# EAGLE design BleShield (EAGLE 6.4)
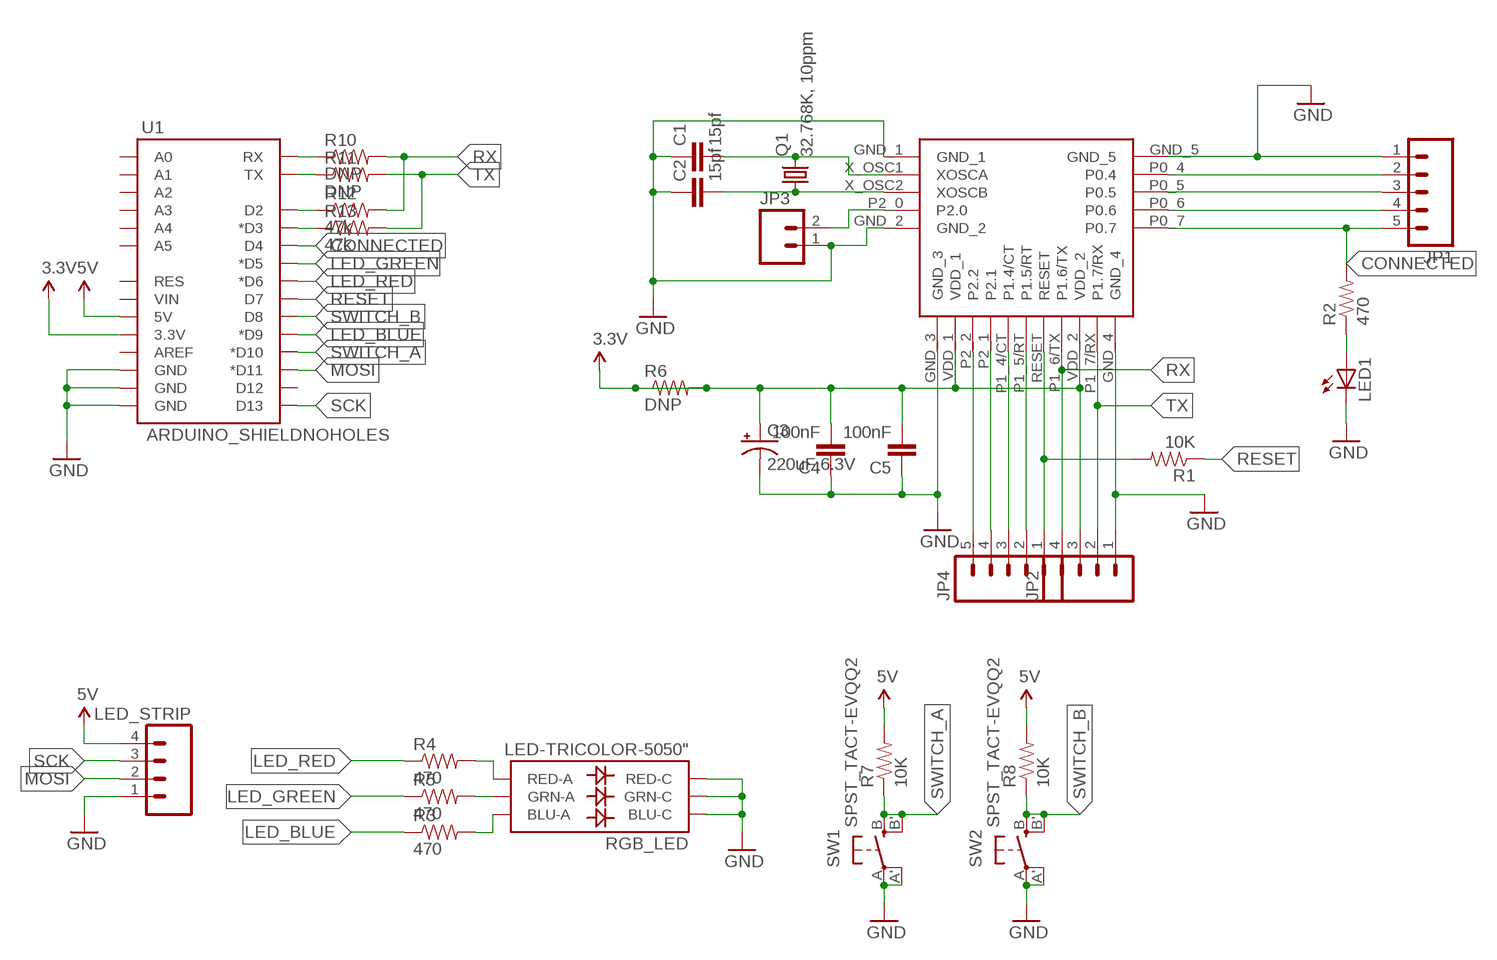
[diagram p0: schematic, sheet 1]

## Parts
C1  15pf  CAP0805  [0805]
C2  15pf  CAP0805  [0805]
C3  220uF 6.3V  CPOL-USC/6032-28R  [C/6032-28R]
C4  100nF  CAP0805  [0805]
C5  100nF  CAP0805  [0805]
JP1  M051.27MM  [1X05-1.27MM]
JP2  M041.27MM  [1X04-1.27MM]
JP3  M02  [1X02-1.27MM]
JP4  M051.27MM  [1X05-1.27MM]
LED1  LEDCHIPLED_0805  [CHIPLED_0805]
LED_STRIP  M04PTH  [1X04]
Q1  32.768K, 10ppm  CRYSTAL3215  [CRYSTAL_3215]
R1  10K  RESISTOR0805-RES  [0805]
R2  470  RESISTOR0805-RES  [0805]
R3  470  RESISTOR0805-RES  [0805]
R4  470  RESISTOR0805-RES  [0805]
R5  470  RESISTOR0805-RES  [0805]
R6  DNP  RESISTOR0805-RES  [0805]
R7  10K  RESISTOR0805-RES  [0805]
R8  10K  RESISTOR0805-RES  [0805]
R10  DNP  RESISTOR0805-RES  [0805]
R11  DNP  RESISTOR0805-RES  [0805]
R12  47k  RESISTOR0805-RES  [0805]
R13  47k  RESISTOR0805-RES  [0805]
RGB_LED  LED-TRICOLOR-5050"  [LED-TRICOLOR-5050-FIXED]
SW1  SPST_TACT-EVQQ2  [EVQ-Q2]
SW2  SPST_TACT-EVQQ2  [EVQ-Q2]
U1  ARDUINO_SHIELDNOHOLES  [DUEMILANOVE_SHIELD_NOHOLES]
U$1  BG213L  [BG312L]

## Nets
3.3V: C3.+ C4.2 C5.2 JP2.3 R6.1 R6.2 U1.3.3V U$1.VDD_1 U$1.VDD_2
5V: LED_STRIP.4 R7.2 R8.2 U1.5V
CONNECTED: JP1.5 R2.2 U1.D4 U$1.P0_7(P0.7)
GND: C1.1 C2.1 C3.- C4.1 C5.1 JP1.1 JP2.1 JP3.1 LED1.C LED_STRIP.1 RGB_LED.1(BLU-C) RGB_LED.2(RED-C) RGB_LED.3(GRN-C) SW1.A'(P1) SW1.A(P) SW2.A'(P1) SW2.A(P) U1.GND@0(GND) U1.GND@1(GND) U1.GND@2(GND) U$1.GND_1 U$1.GND_2 U$1.GND_3 U$1.GND_4 U$1.GND_5
LED_BLUE: R3.1 U1.D9(*D9)
LED_GREEN: R5.1 U1.D5(*D5)
LED_RED: R4.1 U1.D6(*D6)
MOSI: LED_STRIP.2 U1.D11(*D11)
N$1: JP4.1 R1.2 U$1.RESET
N$2: R3.2 RGB_LED.6(BLU-A)
N$3: C1.2 Q1.P$2 U$1.X_OSC1(XOSCA)
N$4: C2.2 Q1.P$1 U$1.X_OSC2(XOSCB)
N$5: R5.2 RGB_LED.4(GRN-A)
N$6: R4.2 RGB_LED.5(RED-A)
N$7: LED1.A R2.1
N$8: JP4.5 U$1.P2_2(P2.2)
N$9: R12.1 U1.D2
N$10: R10.1 U1.RX
N$11: R11.1 U1.TX
N$12: JP4.4 U$1.P2_1(P2.1)
N$13: JP4.3 U$1.P1_4/CT(P1.4/CT)
N$14: JP4.2 U$1.P1_5/RT(P1.5/RT)
N$15: JP1.2 U$1.P0_4(P0.4)
N$16: JP1.3 U$1.P0_5(P0.5)
N$18: JP1.4 U$1.P0_6(P0.6)
N$19: JP3.2 U$1.P2_0(P2.0)
N$20: R13.1 U1.D3(*D3)
RESET: R1.1 U1.D7
RX: JP2.4 R10.2 R12.2 U$1.P1_6/TX(P1.6/TX)
SCK: LED_STRIP.3 U1.D13
SWITCH_A: R7.1 SW1.B'(S1) SW1.B(S) U1.D10(*D10)
SWITCH_B: R8.1 SW2.B'(S1) SW2.B(S) U1.D8
TX: JP2.2 R11.2 R13.2 U$1.P1_7/RX(P1.7/RX)
Unconnected: U1.A0 U1.A1 U1.A2 U1.A3 U1.A4 U1.A5 U1.AREF U1.D12 U1.RES U1.VIN

## Library data of the parts
C1 C2 C4 C5 = SparkFun:CAP: Capacitor Standard 0603 ceramic capacitor, and 0.1" leaded capacitor.
C3 = rcl:CPOL-US: POLARIZED CAPACITOR, American symbol
JP1 JP4 = SparkFun:M05: Header 5 Standard 5-pin 0.1" header. Use with straight break away headers (SKU : PRT-00116), right angle break away headers (PRT-00553), swiss pins (PRT-00743), machine pins (PRT-00117), and female headers (PRT-00115). Molex polarized connector foot print use with SKU : PRT-08230 with associated crimp pins and housings.
JP2 LED_STRIP = SparkFun:M04: Header 4 Standard 4-pin 0.1" header. Use with straight break away headers (SKU : PRT-00116), right angle break away headers (PRT-00553), swiss pins (PRT-00743), machine pins (PRT-00117), and female headers (PRT-00115). Molex polarized connector foot print use with SKU : PRT-08231 with associated crimp pins and housings. 1MM SMD Version SKU: PRT-10208
JP3 = BLE:M02: Header 2 Standard 2-pin 0.1" header. Use with straight break away headers (SKU : PRT-00116), right angle break away headers (PRT-00553), swiss pins (PRT-00743), machine pins (PRT-00117), and female headers (PRT-00115). Molex polarized connector foot print use with SKU : PRT-08233 with associated crimp pins and housings.
LED1 = adafruit:LED: LED OSRAM: - CHIPLED LG R971, LG N971, LY N971, LG Q971, LY Q971, LO R971, LY R971 LH N974, LH R974 LS Q976, LO Q976, LY Q976 LO Q996 - Hyper CHIPLED LW Q18S LB Q993, LB Q99A, LB R99A - SideLED LS A670, LO A670, LY A670, LG A670, LP A670 LB A673, LV A673, LT A673, LW A673 LH A674 LY A675 LS A676, LA A676, LO A676, LY A676, LW A676 LS A679, LY A679, LG A679 - Hyper Micro SIDELED® LS Y876, LA Y876, LO Y876, LY Y876 LT Y87S - SmartLED LW L88C, LW L88S LB L89C, LB L89S, LG L890 LS L89K, LO L89K, LY L89K LS L896, LA L896, LO L896, LY L896 - TOPLED LS T670, LO T670, LY T670, LG T670, LP T670 LSG T670, LSP T670, LSY T670, LOP T670, LYG T670 LG T671, LOG T671, LSG T671 LB T673, LV T673, LT T673, LW T673 LH T674 LS T676, LA T676, LO T676, LY T676, LB T676, LH T676, LSB T676, LW T676 LB T67C, LV T67C, LT T67C, LS T67K, LO T67K, LY T67K, LW E67C LS E67B, LA E67B, LO E67B, LY E67B, LB E67C, LV E67C, LT E67C LW T67C LS T679, LY T679, LG T679 LS T770, LO T770, LY T770, LG T770, LP T770 LB T773, LV T773, LT T773, LW T773 LH T774 LS E675, LA E675, LY E675, LS T675 LS T776, LA T776, LO T776, LY T776, LB T776 LHGB T686 LT T68C, LB T68C - Hyper Mini TOPLED® LB M676 - Mini TOPLED Santana® LG M470 LS M47K, LO M47K, LY M47K Source: http://www.osram.convergy.de/
Q1 = blinkinlabs:CRYSTAL: CRYSTAL
R1-R8 R10-R13 = SparkFun:RESISTOR: Resistor Basic schematic elements and footprints for 0603, 1206, and PTH resistors.
RGB_LED = blinkinlabs:LED-TRICOLOR-5050
SW1 SW2 = adafruit:SPST_TACT: SMT 6mm switch, EVQQ2 series http://www.ladyada.net/library/eagle
U1 = SparkFun:ARDUINO_SHIELD
U$1 = BLE:BG213L

## Board
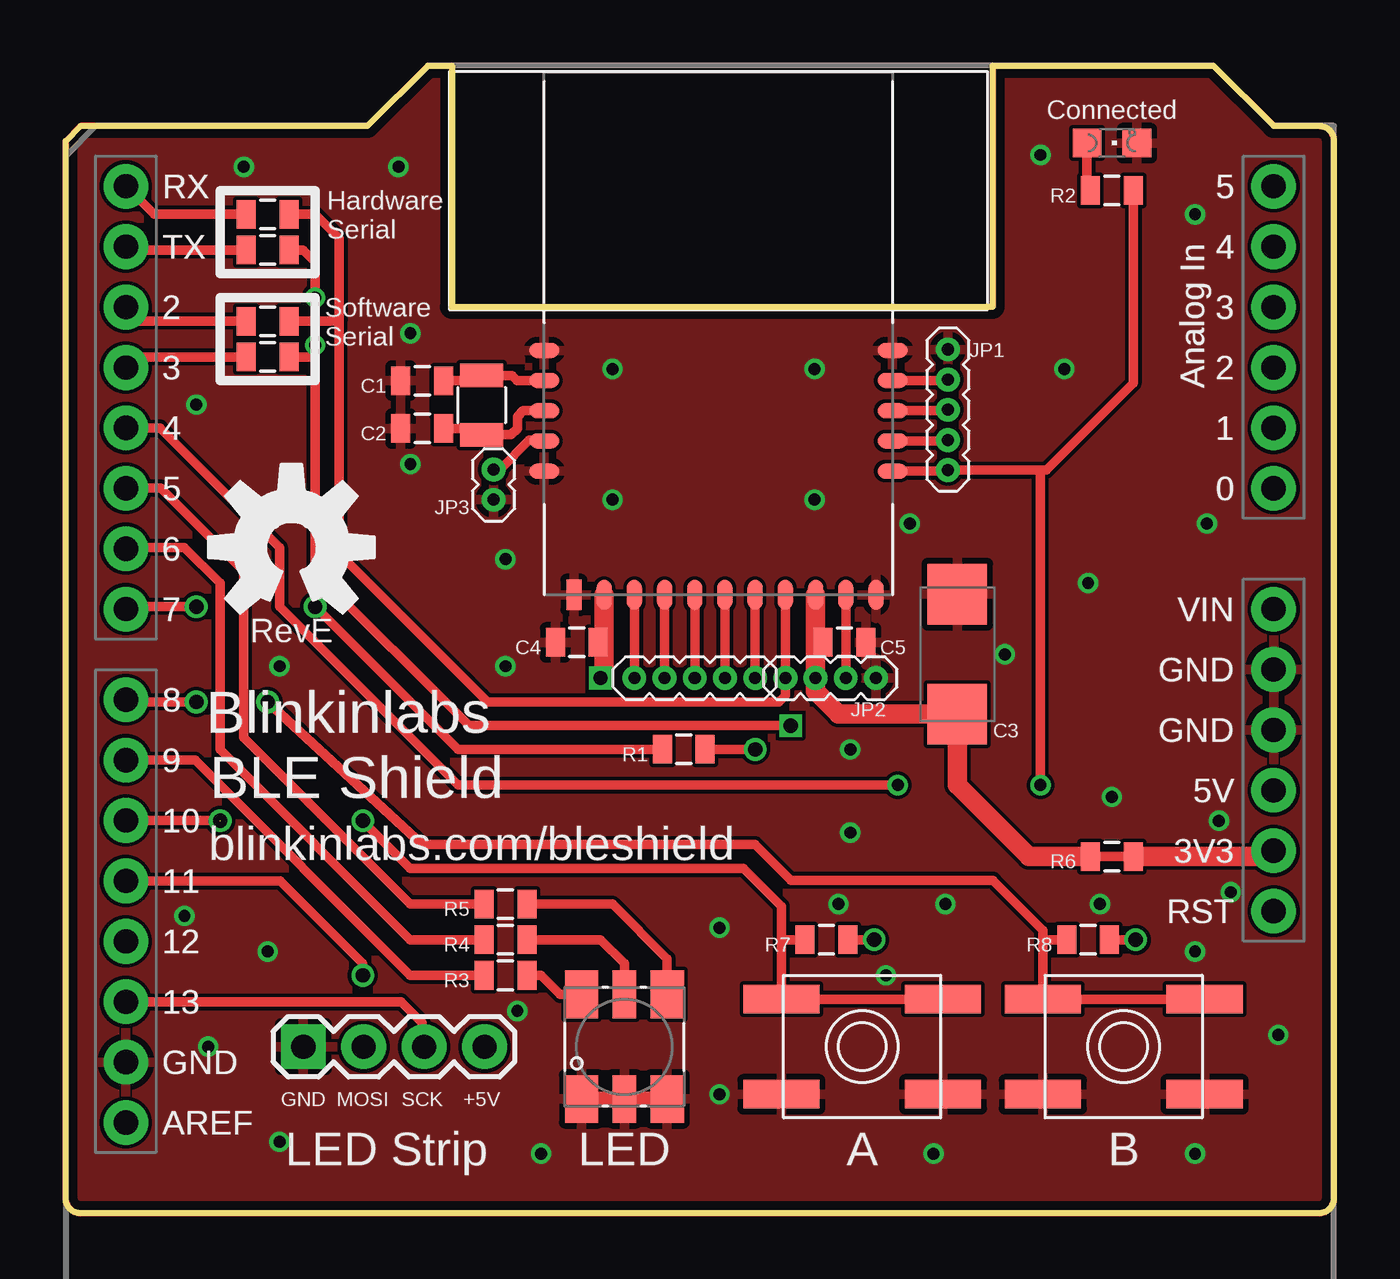
[diagram p1: board, top side]
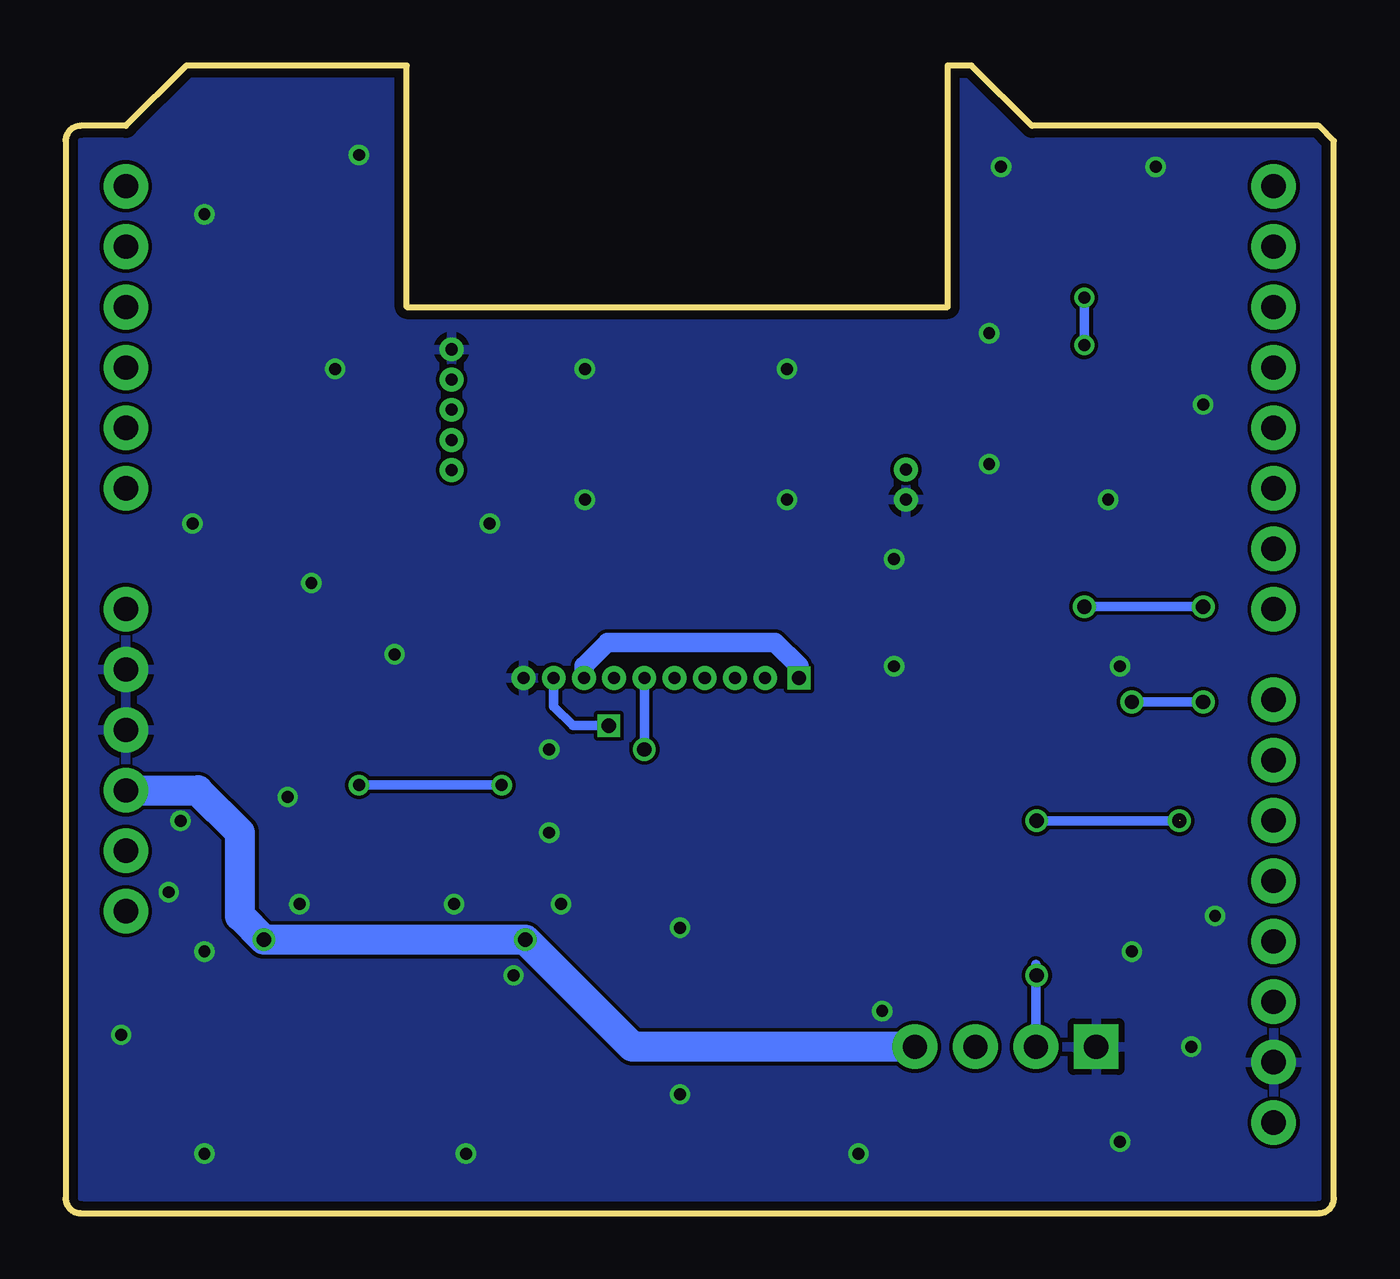
[diagram p2: board, bottom side, seen from below]

Size 53.34 x 48.26 mm. Coordinates in mm from the lower left corner, seen from the top.
Outline: 50.8,45.72 52.7,45.72 arc-90 53.34,45.09 53.34,0.64 arc-90 52.7,0 0.64,0 arc-90 0,0.64 0,45.09 0.64,45.72 12.7,45.72 15.24,48.26 16.26,48.26 16.26,38.1 38.99,38.1 38.99,48.26 48.26,48.26 50.8,45.72
Copper layers (1*16): Top 0.0356mm / dielectric 1.5011mm / Bottom 0.0356mm
Design rules "default *": minimum track width 6mil, minimum drill 13mil, track to track 6mil, track to pad 6mil, pad to pad 6mil, via to via 6mil, smd to smd 6mil, copper to edge 15mil, drill to drill 6mil, minimum pad ring 7mil, minimum via ring 7mil, stop-mask expansion 0mil, vias tented up to drill 0mil, thermal gap 10mil
tRestrict: area 8,35.5 to 9,38; area 8,40 to 9,42.5; area 43.5,14.5 to 44.5,15.5; area 15.5,33.5 to 20,35.5

### Footprints (pad centres in the part's own frame; a part is rotated, then mirrored left to right if it is on the bottom)
0805 = smd 0.8 x 1.2: 1 -0.9,0; 2 0.9,0
C/6032-28R = smd 2.55 x 2.5: + 2.525,0; - -2.525,0
1X05-1.27MM = drill 0.508 pad 1: 1 0,0; 2 1.27,0; 3 2.54,0; 4 3.81,0; 5 5.08,0
1X04-1.27MM = drill 0.508 pad 1: 1 0,0; 2 1.27,0; 3 2.54,0; 4 3.81,0
1X02-1.27MM = drill 0.508 pad 1: 1 0,0; 2 1.27,0
CHIPLED_0805 = smd 1.2 x 1.2: A 0,-1.05; C 0,1.05
1X04 = drill 1.016 pad 1.88 square: 1 0,0 | drill 1.016 pad 1.88: 2 2.54,0; 3 5.08,0; 4 7.62,0
CRYSTAL_3215 = smd 1 x 1.8: P$1 -1.27,0; P$2 1.23,0
LED-TRICOLOR-5050-FIXED = smd 2 x 1.4: 1 -2.2,1.8; 3 -2.2,-1.8; 4 2.2,-1.8; 6 2.2,1.8 | smd 2 x 1: 2 -2.2,0; 5 2.2,0
EVQ-Q2 = smd 3.2 x 1.2: A -3.4,-2; A' 3.4,-2; B -3.4,2; B' 3.4,2
DUEMILANOVE_SHIELD_NOHOLES = drill 1.016 pad 1.88: 3.3V 50.8,26.67; 5V 50.8,29.21; A0 50.8,41.91; A1 50.8,44.45; A2 50.8,46.99; A3 50.8,49.53; A4 50.8,52.07; A5 50.8,54.61; AREF 2.54,15.24; D2 2.54,49.53; D3 2.54,46.99; D4 2.54,44.45; D5 2.54,41.91; D6 2.54,39.37; D7 2.54,36.83; D8 2.54,33.02; D9 2.54,30.48; D10 2.54,27.94; D11 2.54,25.4; D12 2.54,22.86; D13 2.54,20.32; GND@0 50.8,31.75; GND@1 50.8,34.29; GND@2 2.54,17.78; RES 50.8,24.13; RX 2.54,54.61; TX 2.54,52.07; VIN 50.8,36.83
BG312L = smd 1.27 x 0.635: GND_1 0,10.28; GND_2 0,5.2; GND_5 14.65,10.28; P0_4 14.65,9.01; P0_5 14.65,7.74; P0_6 14.65,6.47; P0_7 14.65,5.2; P2_0 0,6.47; X_OSC1 0,9.01; X_OSC2 0,7.74 | smd 0.635 x 1.27: GND_3 1.25,0; GND_4 13.95,0; P1_4/CT 6.33,0; P1_5/RT 7.6,0; P1_6/TX 10.14,0; P1_7/RX 12.68,0; P2_1 5.06,0; P2_2 3.79,0; RESET 8.87,0; VDD_1 2.52,0; VDD_2 11.41,0

### Placement (x,y rotation side)
C1  15,35 0 top
C2  15,33 0 top
C3  37.5,23.5 270 top
C4  21.5,24 0 top
C5  32.75,24 180 top
JP1  37.11,36.32 270 top
JP2  34.08,22.5 180 top
JP3  18,30 90 top
JP4  29,22.5 180 top
LED1  44,45 270 top
LED_STRIP  10,7 0 top
Q1  17.5,34 90 top
R1  26,19.5 0 top
R2  44,43 0 top
R3  18.5,10 0 top
R4  18.5,11.5 0 top
R5  18.5,13 0 top
R6  44,15 180 top
R7  32,11.5 0 top
R8  43,11.5 0 top
R10  8.5,42 0 top
R11  8.5,40.5 0 top
R12  8.5,37.5 0 top
R13  8.5,36 0 top
RGB_LED  23.5,7 90 top
SW1  33.5,7 0 top
SW2  44.5,7 0 top
U1  0,-11.43 0 top
U$1  20.13,26 0 top
U$7  [OSHW-LOGO-L]  9.5,28 0 top

### Tracks (layer width: path | path; a pad name or v marks a point on that pad's centre or on a via)
3.3V  (via drill 0.6)
  Top 0.406: R6.2 R6.1
  Top 0.813: 37.48,21 C3.+ | C3.+ 37.5,18 40.5,15 R6.2 | R6.1 50.56,15 U1.3.3V | 31.54,24 JP2.3 31.54,21.96 32.5,21 37.48,21 | U$1.VDD_2 31.54,24 | 31.54,24 C5.2 | 22.65,24 22.65,22.5 v22.5,22.5 | U$1.VDD_1 22.65,24 | 22.65,24 C4.2 | 37.48,21 37.52,21 C3.+
  Bottom 0.813: v22.5,22.5 22.5,23 23.5,24 30.54,24 31.54,23 JP2.3
5V  (via drill 0.6)
  Top 0.406: R8.2 v45,11.5 | R7.2 v34,11.5
  Bottom 1.27: LED_STRIP.4 29.5,7 v34,11.5 34.5,11.5 v45,11.5 46,12.5 46,16 47.78,17.78 U1.5V
CONNECTED  (via drill 0.5)
  Top 0.406: 41,31.24 JP1.5 37.07,31.2 U$1.P0_7 | 41,31.24 41.24,31.24 44.9,34.9 R2.2 | v35,18 16.5,18 9,25.5 9,28 3.98,33.02 U1.D4 | v41,18 41,31.24
  Bottom 0.406: v35,18 v41,18
GND  (via drill 0.5)
  Top 0.406: 20.44,31.11 U$1.GND_2
  Top 0.61: RGB_LED.3 RGB_LED.2 RGB_LED.1
  other vias: 5.5,34 9.5,30 5,12.5 8.5,11 18.5,27.5 18.5,23 23,35.5 14,44 7.5,44 14.5,37 41,44.5 42,35.5 47.5,42 48,29 43,26.5 39.5,23.5 35.5,29 31.5,30 23,30 31.5,35.5 33,19.5 33,16 9,23 27.5,12 6,7 9,3 20,2.5 14.5,31.5 19,8.5 27.5,5 36.5,2.5 34.5,10 32.5,13 37,13 43.5,13 44,17.5 48.5,16.5 49,13.5 47.5,11 51,7.5 47.5,2.5
  pour Bottom: 53.34,48.26 53.34,0 0,0 0,48.26
  pour Top: 53.34,48.26 53.34,0 0,0 0,48.26
LED_BLUE
  Top 0.406: U1.D9 5.45,19.05 14.5,10 R3.1
LED_GREEN
  Top 0.406: R5.1 14.5,13 7.5,20 7.5,27 4,30.5 2.56,30.5 U1.D5
LED_RED
  Top 0.406: R4.1 14.5,11.5 6.5,19.5 6.5,26.5 5,28 2.6,28 U1.D6
MOSI  (via drill 0.6)
  Top 0.406: U1.D11 9.03,13.97 12.5,10.5 v12.5,10
  Bottom 0.406: LED_STRIP.2 12.54,10.46 v12.5,10
N$1  (via drill 0.6)
  Top 0.406: U$1.RESET JP4.1 | R1.2 v29,19.5
  Bottom 0.406: v29,19.5 JP4.1
N$2
  Top 0.406: RGB_LED.6 20.8,9.2 20,10 R3.2
N$3
  Top 0.406: U$1.X_OSC1 18.99,35.01 18.77,35.23 Q1.P$2 17.27,35 C1.2
N$4
  Top 0.406: U$1.X_OSC2 19.24,33.74 19,33.5 19,33 18.73,32.73 Q1.P$1 17.23,33 C2.2
N$5
  Top 0.406: R5.2 23,13 25.3,10.7 RGB_LED.4
N$6
  Top 0.406: R4.2 22.5,11.5 23.5,10.5 RGB_LED.5
N$7
  Top 0.406: LED1.A 42.95,43.15 R2.1
N$8
  Top 0.406: U$1.P2_2 JP4.5
N$9
  Top 0.406: R12.1 3.14,37.5 U1.D2
N$10
  Top 0.406: R10.1 3.72,42 U1.RX
N$11
  Top 0.406: R11.1 2.68,40.5 U1.TX
N$12
  Top 0.406: JP4.4 U$1.P2_1
N$13
  Top 0.406: U$1.P1_4/CT JP4.3
N$14
  Top 0.406: JP4.2 U$1.P1_5/RT
N$15
  Top 0.406: U$1.P0_4 37.07,35.01 JP1.2
N$16
  Top 0.406: U$1.P0_5 37.07,33.74 JP1.3
N$17
  Top 0.254: 12.7,45.72 0.64,45.72 0,45.09 0,0.64 arc90 0.64,0 52.7,0 arc90 53.34,0.64 53.34,45.09 arc90 52.7,45.72 50.8,45.72 48.26,48.26 38.99,48.26 38.99,38.1 16.26,38.1 16.26,48.26 15.24,48.26 12.7,45.72
N$18
  Top 0.406: U$1.P0_6 37.07,32.47 JP1.4
N$19
  Top 0.406: JP3.2 18.27,31.27 19.5,32.5 20.1,32.5 U$1.P2_0
N$20
  Top 0.406: R13.1 2.98,36 U1.D3
RESET  (via drill 0.6)
  Top 0.406: v5.5,25.5 2.64,25.5 U1.D7 | R1.1 16.5,19.5 v10.5,25.5
  Bottom 0.406: v5.5,25.5 v10.5,25.5
RX
  Top 0.406: U$1.P1_6/TX JP2.4 30.27,21.77 30,21.5 17.74,21.5 11.5,27.74 11.5,37.5 | 11.5,37.5 R12.2 | R10.2 10.5,42 11.5,41 11.5,37.5
SCK
  Top 0.406: U1.D13 14.11,8.89 15,8 15,7.08 LED_STRIP.3
SWITCH_A  (via drill 0.6)  (1 unrouted)
  Top 0.406: v12.5,16.5 14.5,14.5 28.5,14.5 30.1,12.9 30.1,11.5 | v6.49,16.51 U1.D10 | SW1.B 30.1,9.5 | 30.1,9.5 30.1,11.5 | SW1.B' 30.6,9 30.1,9.5 | R7.1 30.1,11.5
  Bottom 0.406: v6.5,16.5 v12.5,16.5
SWITCH_B  (via drill 0.6)
  Top 0.406: v8.5,21.5 15,15.5 29,15.5 30.5,14 39,14 41.1,11.9 41.1,11.5 | v5.5,21.5 2.63,21.5 U1.D8 | 41.1,11.5 SW2.B SW2.B' | R8.1 41.1,11.5
  Bottom 0.406: v5.5,21.5 v8.5,21.5
TX  (via drill 0.5, 0.6)
  Top 0.406: U$1.P1_7/RX JP2.2 | 10.5,36 10.5,26.96 16.96,20.5 v30.5,20.5 | 10.5,36 R13.2 | R11.2 10,40.5 10.5,40 v10.5,38.5 | v10.5,36.5 10.5,36
  Bottom 0.406: v10.5,38.5 v10.5,36.5 | v30.5,20.5 32,20.5 32.81,21.31 JP2.2

### Text on the board
tNames: Connected | RX | Hardware / Serial | 5 | TX | 4 | 2 | Software / Serial | 3 | 3 | Analog In | 2 | 4 | 1 | 5 | 0 | 6 | 7 | VIN | RevE | GND | 8 | Blinkinlabs | GND | 9 | BLE Shield | 5V | 10 | blinkinlabs.com/bleshield | 3V3 | 11 | RST | 12 | 13 | GND | GND | MOSI | SCK | +5V | AREF | LED Strip | LED | A | B